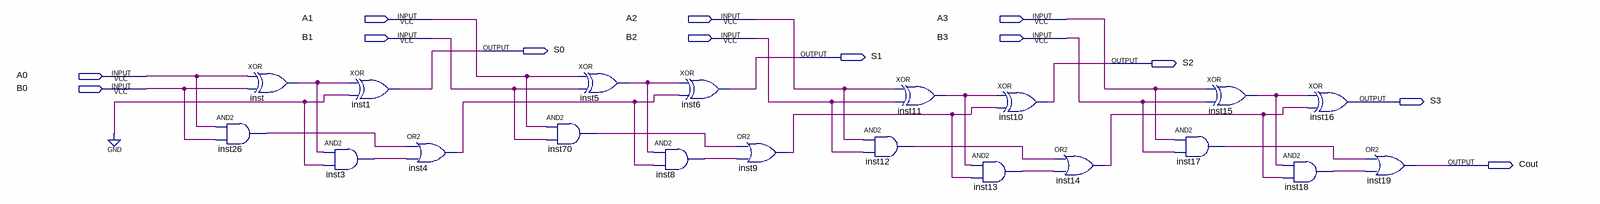
[diagram p0: schematic sheet]
// Quartus schematic adder.bdf as structural Verilog: 20 symbols, 13 pins
module adder (
  input  A1,
  input  A2,
  input  A3,
  input  B1,
  input  B2,
  input  B3,
  input  A0,
  input  B0,
  output S0,
  output S1,
  output S2,
  output S3,
  output Cout
);

  wire inst3_out, inst4_out, inst5_out, inst8_out, inst9_out, inst11_out, inst12_out, inst13_out, inst14_out,
       inst15_out, inst17_out, inst18_out, inst26_out, inst70_out, inst_out;

  xor inst (inst_out, A0, B0);
  and inst26 (inst26_out, A0, B0);
  xor inst1 (S0, inst_out, 1'b0);
  and inst3 (inst3_out, inst_out, 1'b0);
  or inst4 (inst4_out, inst26_out, inst3_out);
  and inst70 (inst70_out, A1, B1);
  xor inst5 (inst5_out, A1, B1);
  and inst8 (inst8_out, inst5_out, inst4_out);
  xor inst6 (S1, inst5_out, inst4_out);
  or inst9 (inst9_out, inst70_out, inst8_out);
  and inst12 (inst12_out, A2, B2);
  xor inst11 (inst11_out, A2, B2);
  xor inst10 (S2, inst11_out, inst9_out);
  and inst13 (inst13_out, inst11_out, inst9_out);
  or inst14 (inst14_out, inst12_out, inst13_out);
  xor inst15 (inst15_out, A3, B3);
  and inst17 (inst17_out, A3, B3);
  xor inst16 (S3, inst15_out, inst14_out);
  and inst18 (inst18_out, inst15_out, inst14_out);
  or inst19 (Cout, inst17_out, inst18_out);
endmodule
